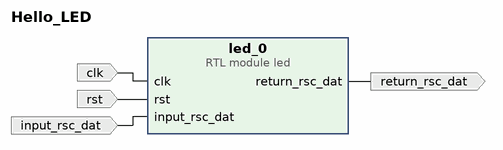
[diagram p0: block diagram of the top level]
# Vivado block design Hello_LED, xc7z020clg400-1, Vivado 2017.2
create_bd_design Hello_LED

create_bd_port -dir I -type clk clk
create_bd_port -dir I -type rst rst
create_bd_port -dir I input_rsc_dat
create_bd_port -dir O return_rsc_dat

create_bd_cell -type module -reference led led_0

# ---- connections ----

connect_bd_net [get_bd_ports clk] [get_bd_pins led_0/clk]
connect_bd_net [get_bd_ports rst] [get_bd_pins led_0/rst]
connect_bd_net [get_bd_ports input_rsc_dat] [get_bd_pins led_0/input_rsc_dat]
connect_bd_net [get_bd_pins led_0/return_rsc_dat] [get_bd_ports return_rsc_dat]

validate_bd_design
save_bd_design
